# EAGLE design BD0006 (EAGLE 9.5.2)
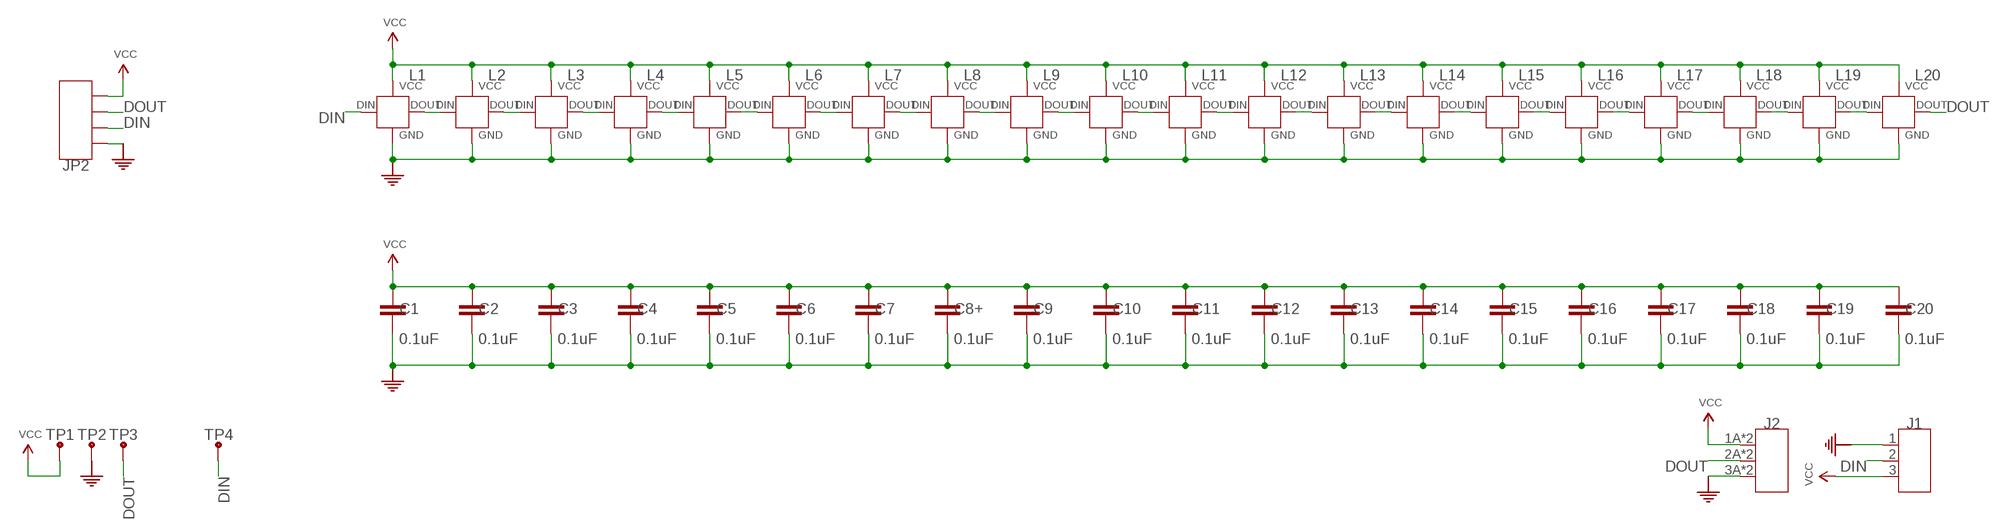
[diagram p0: schematic, sheet 1]

## Parts
C1  0.1uF  CAPACITOR-0402  [0402]
C2  0.1uF  CAPACITOR-0402  [0402]
C3  0.1uF  CAPACITOR-0402  [0402]
C4  0.1uF  CAPACITOR-0402  [0402]
C5  0.1uF  CAPACITOR-0402  [0402]
C6  0.1uF  CAPACITOR-0402  [0402]
C7  0.1uF  CAPACITOR-0402  [0402]
C8+  0.1uF  CAPACITOR-0402  [0402]
C9  0.1uF  CAPACITOR-0402  [0402]
C10  0.1uF  CAPACITOR-0402  [0402]
C11  0.1uF  CAPACITOR-0402  [0402]
C12  0.1uF  CAPACITOR-0402  [0402]
C13  0.1uF  CAPACITOR-0402  [0402]
C14  0.1uF  CAPACITOR-0402  [0402]
C15  0.1uF  CAPACITOR-0402  [0402]
C16  0.1uF  CAPACITOR-0402  [0402]
C17  0.1uF  CAPACITOR-0402  [0402]
C18  0.1uF  CAPACITOR-0402  [0402]
C19  0.1uF  CAPACITOR-0402  [0402]
C20  0.1uF  CAPACITOR-0402  [0402]
J1  HEADER_1X3MALE  [M3SMD_RIGHTANGLE]
J2  HEADER_1X3FEMALE  [F3SMD_RIGHTANGLE]
JP2  HEADER_1X4  [1X04-CLEANBIG]
L1  WS2812B-B  [SK6812-B]
L2  WS2812B-B  [SK6812-B]
L3  WS2812B-B  [SK6812-B]
L4  WS2812B-B  [SK6812-B]
L5  WS2812B-B  [SK6812-B]
L6  WS2812B-B  [SK6812-B]
L7  WS2812B-B  [SK6812-B]
L8  WS2812B-B  [SK6812-B]
L9  WS2812B-B  [SK6812-B]
L10  WS2812B-B  [SK6812-B]
L11  WS2812B-B  [SK6812-B]
L12  WS2812B-B  [SK6812-B]
L13  WS2812B-B  [SK6812-B]
L14  WS2812B-B  [SK6812-B]
L15  WS2812B-B  [SK6812-B]
L16  WS2812B-B  [SK6812-B]
L17  WS2812B-B  [SK6812-B]
L18  WS2812B-B  [SK6812-B]
L19  WS2812B-B  [SK6812-B]
L20  WS2812B-B  [SK6812-B]
TP1  VCC  TEST_POINT  [TEST_POINT]
TP2  GND  TEST_POINT  [TEST_POINT]
TP3  DOUT  TEST_POINT  [TEST_POINT]
TP4  DIN  TEST_POINT  [TEST_POINT]

## Nets
DIN: J1.2 JP2.2 L1.2(DIN) TP4.P$1
DOUT: J2.2A J2.2B JP2.3 L20.4(DOUT) TP3.P$1
GND: C1.P$2 C2.P$2 C3.P$2 C4.P$2 C5.P$2 C6.P$2 C7.P$2 C8+.P$2 C9.P$2 C10.P$2 C11.P$2 C12.P$2 C13.P$2 C14.P$2 C15.P$2 C16.P$2 C17.P$2 C18.P$2 C19.P$2 C20.P$2 J1.1 J2.3A J2.3B JP2.1 L1.1(VSS) L2.1(VSS) L3.1(VSS) L4.1(VSS) L5.1(VSS) L6.1(VSS) L7.1(VSS) L8.1(VSS) L9.1(VSS) L10.1(VSS) L11.1(VSS) L12.1(VSS) L13.1(VSS) L14.1(VSS) L15.1(VSS) L16.1(VSS) L17.1(VSS) L18.1(VSS) L19.1(VSS) L20.1(VSS) TP2.P$1
N$8: L19.4(DOUT) L20.2(DIN)
N$9: L18.4(DOUT) L19.2(DIN)
N$10: L17.4(DOUT) L18.2(DIN)
N$11: L16.4(DOUT) L17.2(DIN)
N$12: L15.4(DOUT) L16.2(DIN)
N$13: L14.4(DOUT) L15.2(DIN)
N$14: L13.4(DOUT) L14.2(DIN)
N$15: L12.4(DOUT) L13.2(DIN)
N$16: L11.4(DOUT) L12.2(DIN)
N$17: L10.4(DOUT) L11.2(DIN)
N$18: L9.4(DOUT) L10.2(DIN)
N$19: L8.4(DOUT) L9.2(DIN)
N$20: L7.4(DOUT) L8.2(DIN)
N$21: L1.4(DOUT) L2.2(DIN)
N$22: L2.4(DOUT) L3.2(DIN)
N$23: L3.4(DOUT) L4.2(DIN)
N$24: L4.4(DOUT) L5.2(DIN)
N$25: L5.4(DOUT) L6.2(DIN)
N$26: L6.4(DOUT) L7.2(DIN)
VCC: C1.P$1 C2.P$1 C3.P$1 C4.P$1 C5.P$1 C6.P$1 C7.P$1 C8+.P$1 C9.P$1 C10.P$1 C11.P$1 C12.P$1 C13.P$1 C14.P$1 C15.P$1 C16.P$1 C17.P$1 C18.P$1 C19.P$1 C20.P$1 J1.3 J2.1A J2.1B JP2.4 L1.3(VDD) L2.3(VDD) L3.3(VDD) L4.3(VDD) L5.3(VDD) L6.3(VDD) L7.3(VDD) L8.3(VDD) L9.3(VDD) L10.3(VDD) L11.3(VDD) L12.3(VDD) L13.3(VDD) L14.3(VDD) L15.3(VDD) L16.3(VDD) L17.3(VDD) L18.3(VDD) L19.3(VDD) L20.3(VDD) TP1.P$1

## Library data of the parts
C1-C7 C8+ C9-C20 = DroidForge:CAPACITOR
J1 = DroidForge:HEADER_1X3; 0-DESC: CONN HEADER SMD R/A 3POS 2.54MM; 1-MN: Samtec Inc.; 2-MPN: TSM-103-01-T-SH; 3-ALT_MN: Sullins Connector Solutions; 4-ALT_MPN: GEC03SBSN-M89; 5-DK_PN: SAM10790-ND
J2 = DroidForge:HEADER_1X3; 0-DESC: CONN RCPT 3POS 0.1 TIN SMD R/A; 1-MN: Samtec Inc.; 2-MPN: SMH-103-02-T-S-TR; 3-ALT_MN: GCT; 4-ALT_MPN: BG300-03-A-L-A; 5-DK_PN: SAM14542CT-ND
JP2 = DroidForge:HEADER_1X4
L1-L20 = DroidForge:WS2812B; 0-DESC: NeoPixel Addressable LED; 1-MN: Worldsemi; 2-MPN: WS2812B-B
TP1-TP4 = DroidForge:TEST_POINT

## Board
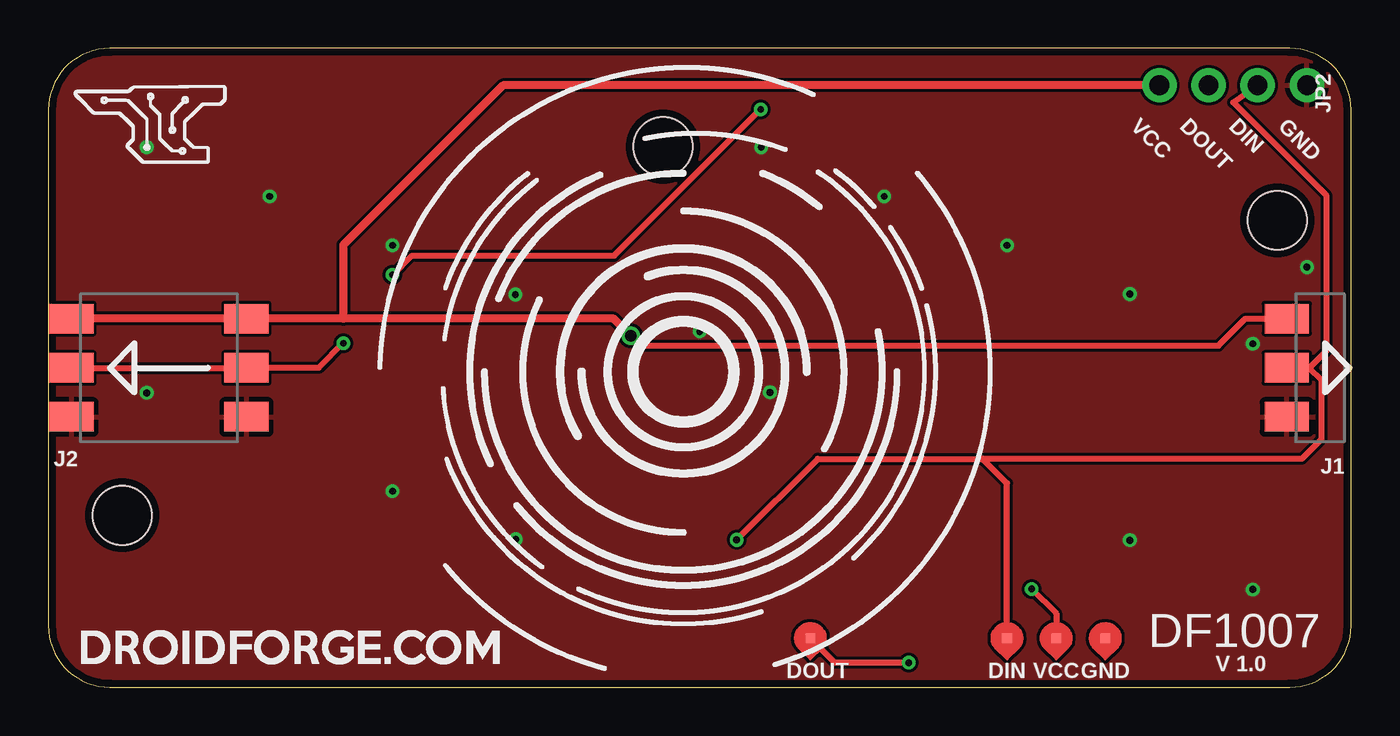
[diagram p1: board, top side]
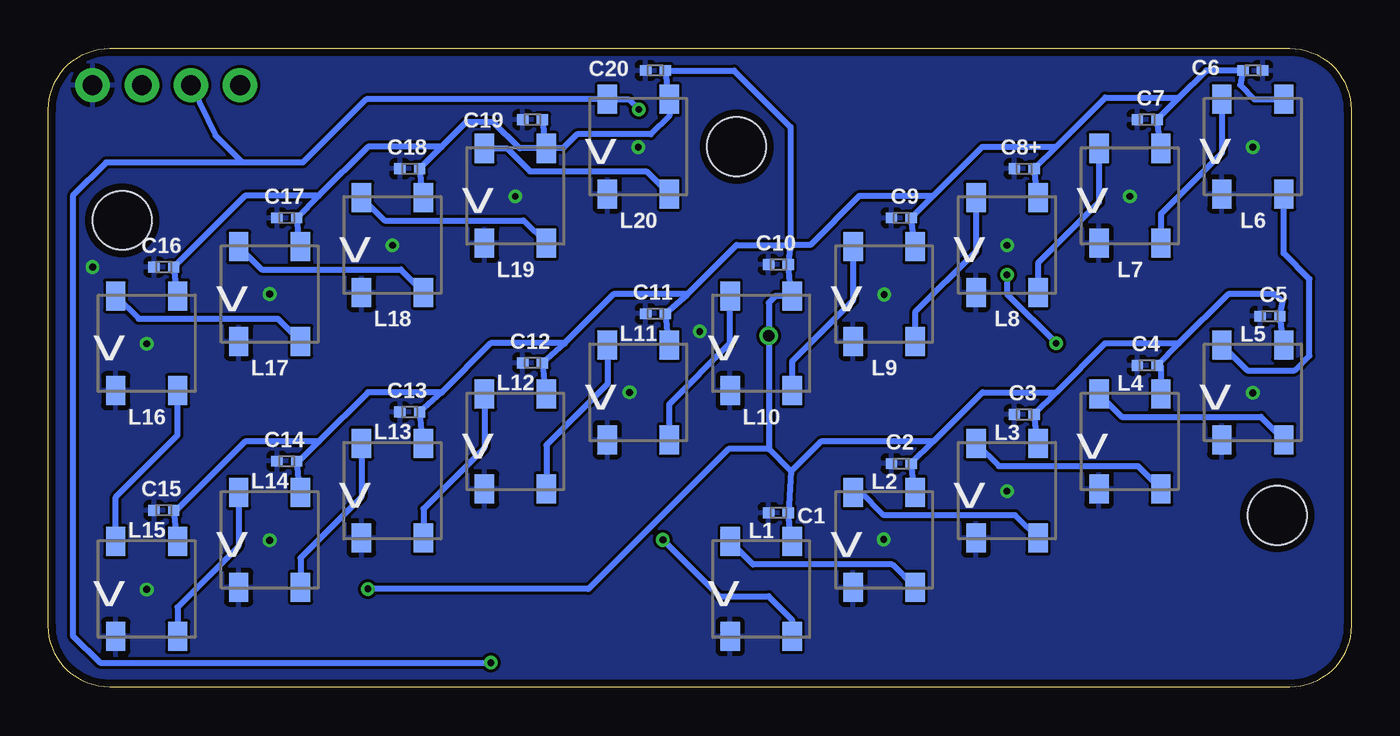
[diagram p2: board, bottom side, seen from below]

Size 67.31 x 33.02 mm. Coordinates in mm from the lower left corner, seen from the top.
Outline: 0,29.84 0,3.17 arc90 3.17,0 64.14,0 arc90 67.31,3.17 67.31,29.84 arc90 64.14,33.02 3.17,33.02 arc90 0,29.84
Copper layers (1*16): Top 0.035mm / dielectric 1.5mm / Bottom 0.035mm
Design rules "default *": minimum track width 6mil, minimum drill 0.35mm, track to track 6mil, track to pad 6mil, pad to pad 6mil, via to via 6mil, smd to smd 6mil, copper to edge 15mil, drill to drill 6mil, minimum pad ring 10mil, minimum via ring 7mil, stop-mask expansion 3mil, vias tented up to drill 25mil, thermal gap 10mil
Holes 3.05 mm at 31.75,27.94 3.81,8.89 63.5,24.13

### Footprints (pad centres in the part's own frame; a part is rotated, then mirrored left to right if it is on the bottom)
0402 = smd 0.584 x 0.559: P$1 -0.508,0; P$2 0.508,0
M3SMD_RIGHTANGLE = smd 1.524 x 2.286: 1 -2.54,4.521; 2 0,4.521; 3 2.54,4.521
F3SMD_RIGHTANGLE = smd 1.524 x 2.286: 1A -2.54,4.521; 1B -2.54,-4.521; 2A 0,4.521; 2B 0,-4.521; 3A 2.54,4.521; 3B 2.54,-4.521
1X04-CLEANBIG = drill 1.016 pad 1.778: 1 -3.81,0; 2 -1.27,0; 3 1.27,0; 4 3.81,0
SK6812-B = smd 1.5 x 1: 1 -2.45,1.6; 2 -2.45,-1.6; 3 2.45,-1.6; 4 2.45,1.6
TEST_POINT = smd 0.508 x 0.508: P$1 0,0

### Placement (x,y rotation side)
C1  29.59,9.02 180 bottom
C2  23.24,11.56 180 bottom
C3  16.89,14.1 180 bottom
C4  10.54,16.64 180 bottom
C5  4.19,19.18 180 bottom
C6  5.08,31.88 0 bottom
C7  10.54,29.34 180 bottom
C8+  16.89,26.8 180 bottom
C9  23.24,24.26 180 bottom
C10  29.59,21.84 180 bottom
C11  35.94,19.3 180 bottom
C12  42.29,16.76 180 bottom
C13  48.64,14.22 180 bottom
C14  54.99,11.68 180 bottom
C15  61.34,9.14 180 bottom
C16  61.34,21.72 180 bottom
C17  54.99,24.26 180 bottom
C18  48.64,26.8 180 bottom
C19  42.29,29.34 180 bottom
C20  35.94,31.88 180 bottom
J1  68.5,16.51 90 top
J2  5.71,16.51 270 top
JP2  61.21,31.11 180 top
L1  30.48,5.08 90 bottom
L2  24.13,7.62 90 bottom
L3  17.78,10.16 90 bottom
L4  11.43,12.7 90 bottom
L5  5.08,15.24 90 bottom
L6  5.08,27.94 90 bottom
L7  11.43,25.4 90 bottom
L8  17.78,22.86 90 bottom
L9  24.13,20.32 90 bottom
L10  30.48,17.78 90 bottom
L11  36.83,15.24 90 bottom
L12  43.18,12.7 90 bottom
L13  49.53,10.16 90 bottom
L14  55.88,7.62 90 bottom
L15  62.23,5.08 90 bottom
L16  62.23,17.78 90 bottom
L17  55.88,20.32 90 bottom
L18  49.53,22.86 90 bottom
L19  43.18,25.4 90 bottom
L20  36.83,27.94 90 bottom
TP1  52.07,2.54 0 top
TP2  54.61,2.54 0 top
TP3  39.37,2.54 0 top
TP4  49.53,2.54 0 top

### Tracks (layer width: path | path; a pad name or v marks a point on that pad's centre or on a via)
DIN  (via drill 0.35)
  Top 0.305: 48.26,11.81 64.77,11.81 65.79,12.83 65.79,15.88 65.15,16.51 | TP4.P$1 49.53,10.54 48.26,11.81 | v35.56,7.62 39.75,11.81 48.26,11.81 | J1.2 65.15,16.51 | 65.15,16.51 66.04,17.4 66.04,25.4 61.21,30.23 JP2.2
  Bottom 0.305: L1.2 28.88,3.48 30.1,4.7 32.64,4.7 v35.56,7.62
DOUT  (via drill 0.35)
  Top 0.152: 10.16,16.51 J2.2A
  Top 0.305: v15.24,17.78 13.97,16.51 10.16,16.51 J2.2B | v17.78,21.31 18.77,22.3 29.24,22.3 v36.8,29.87 | v44.45,1.27 40.64,1.27 TP3.P$1
  Bottom 0.305: v36.8,29.87 37.33,30.39 L20.4 50.89,30.39 54.17,27.11 57.28,27.11 | v15.24,17.78 v15.24,17.79 17.78,20.33 v17.78,21.31 | 57.28,27.11 64.33,27.11 66.04,25.4 66.04,2.67 64.64,1.27 v44.45,1.27 | JP2.3 58.67,28.51 57.28,27.11
GND  (via drill 0.35)
  other vias: 11.43,25.37 17.78,22.83 24.13,20.29 5.08,27.91 5.08,15.21 17.78,10.13 24.16,7.65 55.88,7.59 62.23,5.05 37.29,15.24 49.53,22.83 55.88,20.32 36.83,27.91 33.66,18.39 65.02,21.72 62.23,17.75 43.18,25.37
  pour Top: -2.54,-2.54 69.85,-2.54 69.85,35.56 -2.54,35.56
  pour Bottom: -2.54,-2.54 69.85,-2.54 69.85,35.56 -2.54,35.56
N$8
  Bottom 0.305: L20.2 36.41,26.67 42.43,26.67 43.61,27.85 L19.4
N$9
  Bottom 0.305: L18.4 49.95,24.13 42.76,24.13 L19.2
N$10
  Bottom 0.305: L17.4 56.3,21.59 49.11,21.59 L18.2
N$11
  Bottom 0.305: L16.4 62.65,19.05 55.46,19.05 L17.2
N$12
  Bottom 0.305: L15.4 63.83,9.83 60.63,13.03 L16.2
N$13
  Bottom 0.305: L14.4 57.48,7.29 60.63,4.14 L15.2
N$14
  Bottom 0.305: L13.4 51.13,9.83 54.28,6.68 L14.2
N$15
  Bottom 0.305: L12.4 44.78,12.37 47.93,9.22 L13.2
N$16
  Bottom 0.305: L11.4 38.43,15.67 41.58,12.52 L12.2
N$17
  Bottom 0.305: L10.4 32.08,17.78 35.23,14.63 L11.2
N$18
  Bottom 0.305: L9.4 25.73,19.99 28.88,16.84 L10.2
N$19
  Bottom 0.305: L8.4 19.38,22.53 22.53,19.38 L9.2
N$20
  Bottom 0.305: L7.4 13.03,25.07 16.18,21.92 L8.2
N$21
  Bottom 0.305: L2.2 23.71,6.35 30.9,6.35 L1.4
N$22
  Bottom 0.305: L3.2 17.36,8.89 24.13,8.89 25.4,10.16 25.49,10.07 L2.4
N$23
  Bottom 0.305: L3.4 18.2,11.43 11.01,11.43 L4.2
N$24
  Bottom 0.305: L4.4 11.85,13.97 4.66,13.97 L5.2
N$25
  Bottom 0.305: L6.2 3.48,22.43 2.16,21.11 2.16,17.14 2.92,16.38 5.37,16.38 L5.4
N$26
  Bottom 0.305: L6.4 6.68,27.61 9.83,24.46 L7.2
VCC  (via drill 0.35, 0.6)
  Top 0.305: v50.8,5.08 52.07,3.81 TP1.P$1 | v30.09,18.17 30.61,17.65 60.45,17.65 61.85,19.05 J1.3
  Top 0.406: 15.24,19.05 29.21,19.05 v30.09,18.17 | 15.24,19.05 15.24,22.86 23.5,31.11 JP2.4 | 15.24,19.05 J2.1A J2.1B
  Bottom 0.305: 8.89,30.48 7.49,31.88 C6.P$1 5.73,31.13 4.99,30.39 L6.3 | 15.24,27.94 12.7,30.48 8.89,30.48 | 21.59,25.4 19.05,27.94 15.24,27.94 | 34.29,20.32 31.75,22.86 28.96,22.86 | 40.64,17.78 38.1,20.32 34.29,20.32 | 53.34,12.7 50.8,15.24 46.99,15.24 | 21.59,12.7 19.05,15.24 15.24,15.24 | 53.34,25.4 50.8,27.94 46.99,27.94 | 21.59,25.4 25.4,25.4 27.94,22.86 28.96,22.86 | 28.96,22.86 28.94,22.84 C10.P$1 28.94,20.29 L10.3 29.73,20.23 30.09,19.88 v30.09,18.17 30.09,12.31 | 28.96,22.86 28.96,28.96 31.88,31.88 C20.P$1 35.29,30.45 L20.3 35.23,29.54 36.2,28.57 40.01,28.57 40.73,27.85 L19.3 | L9.3 22.59,22.83 C9.P$1 21.59,25.4 | 15.24,27.94 C8+.P$1 16.24,25.37 L8.3 | L7.3 9.89,27.91 C7.P$1 8.89,30.48 | 40.64,17.78 44.45,17.78 46.99,15.24 | 53.34,12.7 57.15,12.7 60.69,9.16 C15.P$1 60.69,7.59 L15.3 | L12.3 41.64,15.21 C12.P$1 40.64,17.77 40.64,17.78 | 46.99,15.24 46.99,15.22 C13.P$1 47.99,12.67 L13.3 | L14.3 54.34,10.13 C14.P$1 54.34,11.7 53.34,12.7 | 34.29,20.32 34.29,20.3 C11.P$1 35.29,17.75 L11.3 | 15.24,15.24 C3.P$1 16.24,12.67 L3.3 | 21.59,12.7 C2.P$1 22.59,10.13 L2.3 | L1.3 28.94,7.59 C1.P$1 28.94,11.16 | L4.3 9.83,16.58 C4.P$1 8.89,17.78 | L5.3 3.54,17.75 C5.P$1 3.54,19.92 3.94,20.32 6.35,20.32 8.89,17.78 | 15.24,15.24 12.7,17.78 8.89,17.78 | 53.34,25.4 57.15,25.4 C16.P$1 60.69,20.29 L16.3 | L17.3 54.34,22.83 C17.P$1 53.34,25.4 | 46.99,27.94 C18.P$1 47.99,25.37 L18.3 | C19.P$1 41.64,27.91 L19.3 | L19.3 42.96,27.85 44.32,29.21 45.72,29.21 46.99,27.94 | 28.94,11.16 30.09,12.31 | 28.94,11.16 27.4,12.7 21.59,12.7 | 30.09,12.31 32.18,12.31 39.41,5.08 v50.8,5.08

### Text on the board
tPlace: VCC | DOUT | DIN | GND | DF1007 | V 1.0